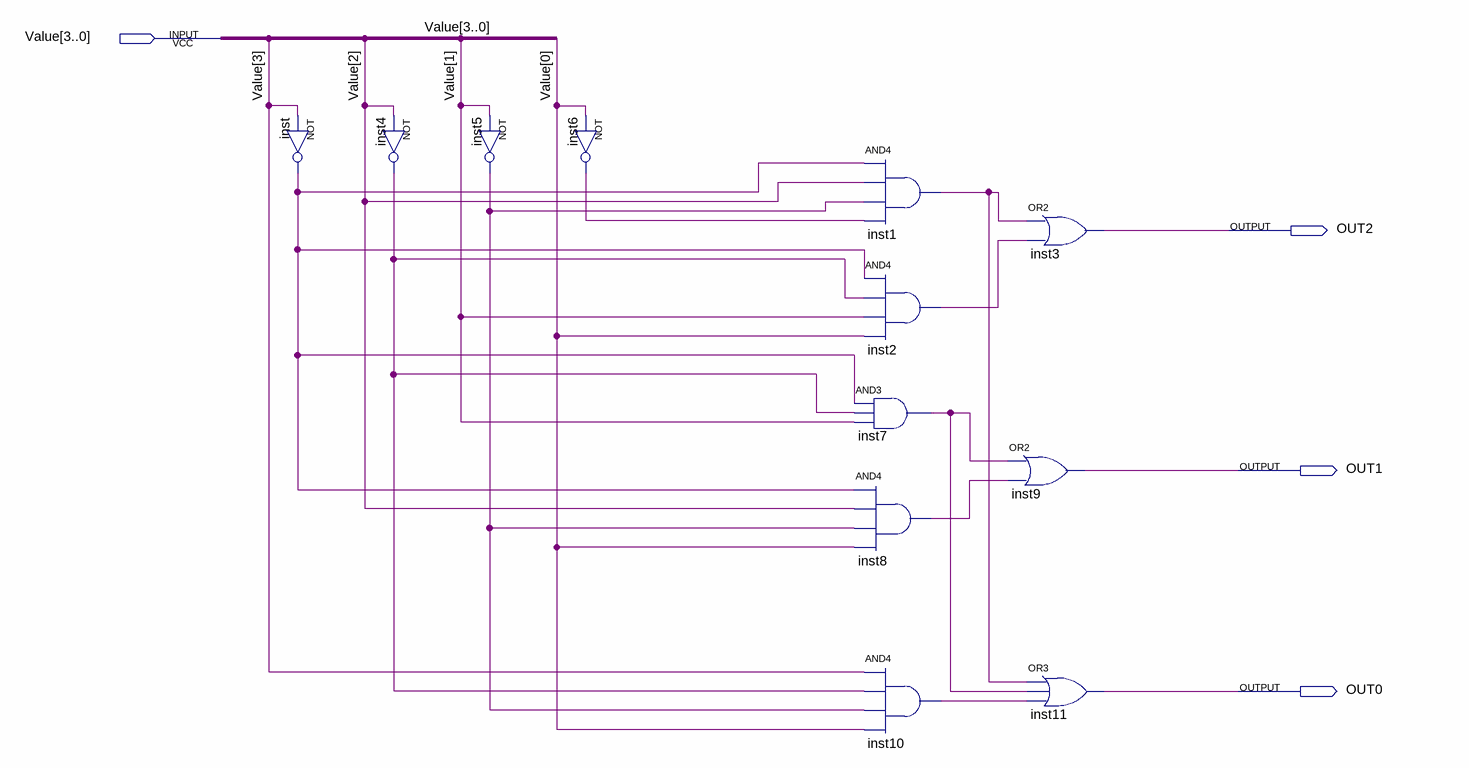
[diagram p0: schematic sheet]
// Quartus schematic EnCoder.bdf as structural Verilog: 12 symbols, 4 pins
module EnCoder (
  input  [3:0] Value,
  output OUT2,
  output OUT1,
  output OUT0
);

  wire inst1_out, inst2_out, inst4_out, inst5_out, inst6_out, inst7_out, inst8_out, inst10_out, inst_out;

  not inst (inst_out, Value[3]);
  not inst4 (inst4_out, Value[2]);
  not inst5 (inst5_out, Value[1]);
  not inst6 (inst6_out, Value[0]);
  and inst1 (inst1_out, inst_out, Value[2], inst5_out, inst6_out);
  and inst2 (inst2_out, inst_out, inst4_out, Value[1], Value[0]);
  and inst7 (inst7_out, inst_out, inst4_out, Value[1]);
  and inst8 (inst8_out, inst_out, Value[2], inst5_out, Value[0]);
  and inst10 (inst10_out, Value[3], inst4_out, inst5_out, Value[0]);
  or inst3 (OUT2, inst1_out, inst2_out);
  or inst9 (OUT1, inst7_out, inst8_out);
  or inst11 (OUT0, inst1_out, inst7_out, inst10_out);
endmodule
